# Altium schematic sheet Master MicroController.SchDoc: Master Micro Controller
size A3; DocumentNumber: 13; SheetNumber: 13; SheetTotal: 54
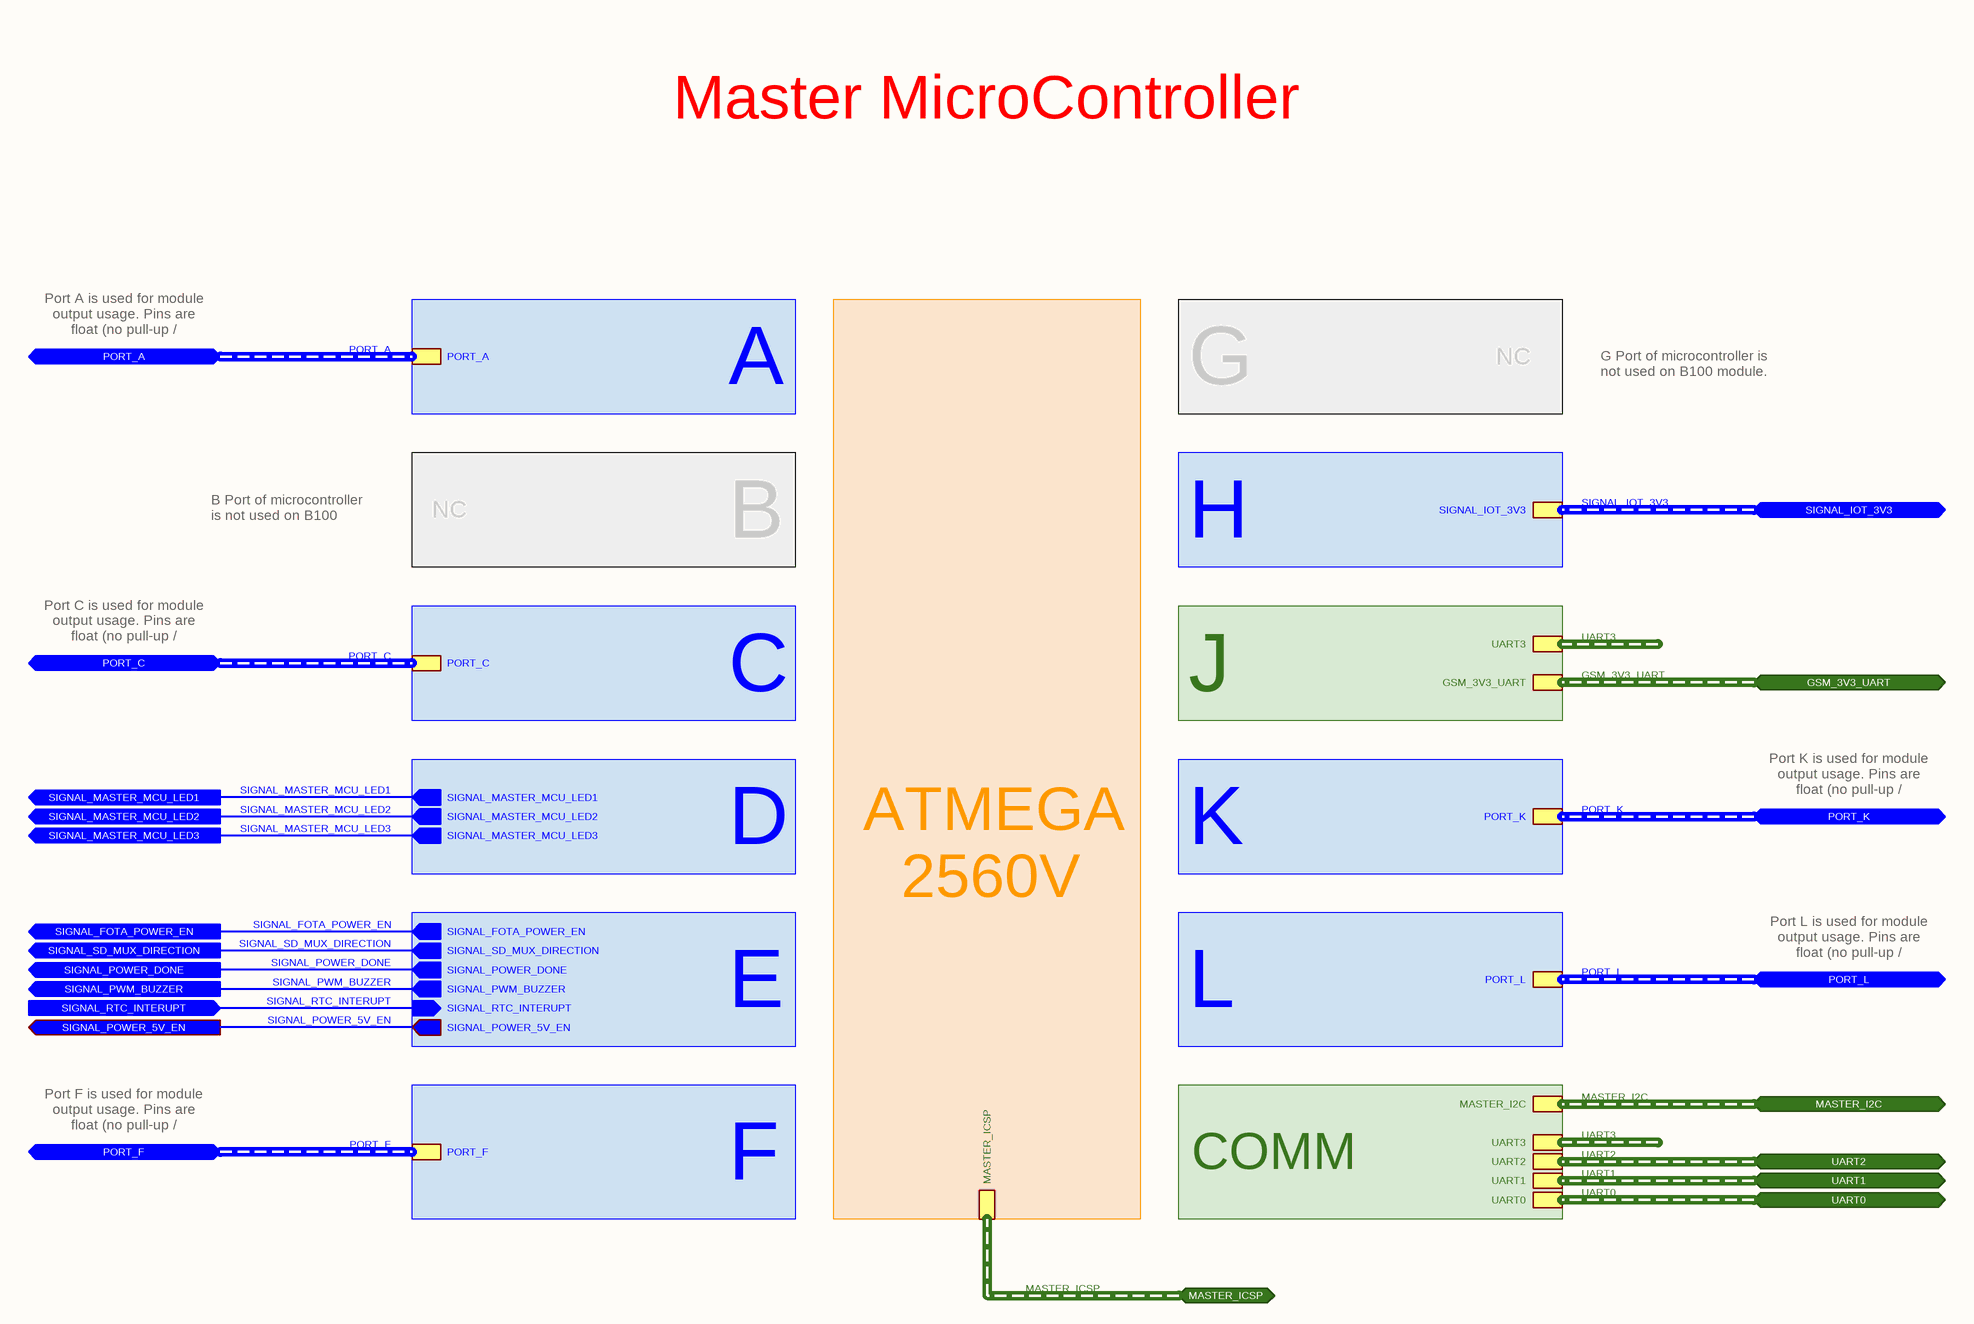
[diagram p0: Master MicroController.SchDoc]

## Sub-sheets
Master MicroController Core = Master MicroController Core.SchDoc: MASTER_ICSP (harness MASTER_ICSP)
PORT A = Master MicroController Port A.SchDoc: PORT_A (harness PORT_A)
PORT B = Master MicroController Port B.SchDoc: no entries
PORT C = Master MicroController Port C.SchDoc: PORT_C (harness PORT_C)
PORT D = Master MicroController Port D.SchDoc: SIGNAL_MASTER_MCU_LED1 (out), SIGNAL_MASTER_MCU_LED3 (out), SIGNAL_MASTER_MCU_LED2 (out)
PORT E = Master MicroController Port E.SchDoc: SIGNAL_FOTA_POWER_EN (out), SIGNAL_SD_MUX_DIRECTION (out), SIGNAL_PWM_BUZZER (out), SIGNAL_RTC_INTERUPT (in), SIGNAL_POWER_DONE (out), SIGNAL_POWER_5V_EN (out)
PORT F = Master MicroController Port F.SchDoc: PORT_F (harness PORT_F)
PORT G = Master MicroController Port G.SchDoc: no entries
PORT H = Master MicroController Port H.SchDoc: SIGNAL_IOT_3V3 (harness SIGNAL_IOT_3V3)
PORT J = Master MicroController Port J.SchDoc: GSM_3V3_UART (harness GSM_3V3_UART), UART3 (harness UART3)
PORT K = Master MicroController Port K.SchDoc: PORT_K (harness PORT_K)
PORT L = Master MicroController Port L.SchDoc: PORT_L (harness PORT_L)
Serial Communication = Master MicroController Serial Communication Port.SchDoc: UART3 (harness UART3), UART1 (harness UART1), UART2 (harness UART2), UART0 (harness UART0), MASTER_I2C (harness MASTER_I2C)

## Ports
GSM_3V3_UART (bidir, harness GSM_3V3_UART), MASTER_I2C (bidir, harness MASTER_I2C), MASTER_ICSP (bidir, harness MASTER_ICSP), PORT_A (bidir, harness PORT_A), PORT_C (bidir, harness PORT_C), PORT_F (bidir, harness PORT_F), PORT_K (bidir, harness PORT_K), PORT_L (bidir, harness PORT_L), SIGNAL_FOTA_POWER_EN (out), SIGNAL_IOT_3V3 (bidir, harness SIGNAL_IOT_3V3), SIGNAL_MASTER_MCU_LED1 (out), SIGNAL_MASTER_MCU_LED2 (out), SIGNAL_MASTER_MCU_LED3 (out), SIGNAL_POWER_5V_EN (out), SIGNAL_POWER_DONE (out), SIGNAL_PWM_BUZZER (out), SIGNAL_RTC_INTERUPT (in), SIGNAL_SD_MUX_DIRECTION (out), UART0 (bidir, harness UART0), UART1 (bidir, harness UART1), UART2 (bidir, harness UART2)

## Nets
SIGNAL_FOTA_POWER_EN: port SIGNAL_FOTA_POWER_EN, sheet PORT E/SIGNAL_FOTA_POWER_EN
SIGNAL_MASTER_MCU_LED1: port SIGNAL_MASTER_MCU_LED1, sheet PORT D/SIGNAL_MASTER_MCU_LED1
SIGNAL_MASTER_MCU_LED2: port SIGNAL_MASTER_MCU_LED2, sheet PORT D/SIGNAL_MASTER_MCU_LED2
SIGNAL_MASTER_MCU_LED3: port SIGNAL_MASTER_MCU_LED3, sheet PORT D/SIGNAL_MASTER_MCU_LED3
SIGNAL_POWER_5V_EN: port SIGNAL_POWER_5V_EN, sheet PORT E/SIGNAL_POWER_5V_EN
SIGNAL_POWER_DONE: port SIGNAL_POWER_DONE, sheet PORT E/SIGNAL_POWER_DONE
SIGNAL_PWM_BUZZER: port SIGNAL_PWM_BUZZER, sheet PORT E/SIGNAL_PWM_BUZZER
SIGNAL_RTC_INTERUPT: port SIGNAL_RTC_INTERUPT, sheet PORT E/SIGNAL_RTC_INTERUPT
SIGNAL_SD_MUX_DIRECTION: port SIGNAL_SD_MUX_DIRECTION, sheet PORT E/SIGNAL_SD_MUX_DIRECTION

## Buses and harness runs
harness GSM_3V3_UART = port GSM_3V3_UART = sheet PORT J/GSM_3V3_UART
harness MASTER_I2C = port MASTER_I2C = sheet Serial Communication/MASTER_I2C
harness MASTER_ICSP = port MASTER_ICSP = sheet Master MicroController Core/MASTER_ICSP
harness PORT_A = port PORT_A = sheet PORT A/PORT_A
harness PORT_C = port PORT_C = sheet PORT C/PORT_C
harness PORT_F = port PORT_F = sheet PORT F/PORT_F
harness PORT_K = port PORT_K = sheet PORT K/PORT_K
harness PORT_L = port PORT_L = sheet PORT L/PORT_L
harness SIGNAL_IOT_3V3 = port SIGNAL_IOT_3V3 = sheet PORT H/SIGNAL_IOT_3V3
harness UART0 = port UART0 = sheet Serial Communication/UART0
harness UART1 = port UART1 = sheet Serial Communication/UART1
harness UART2 = port UART2 = sheet Serial Communication/UART2
harness UART3 = sheet PORT J/UART3
harness UART3 = sheet Serial Communication/UART3

## Notes on the sheet
- Master MicroController
- Port A is used for module output usage. Pins are float (no pull-up / pull-down)
- A
- G
- NC
- G Port of microcontroller is not used on B100 module.
- B Port of microcontroller is not used on B100 module.
- B
- H
- Port C is used for module output usage. Pins are float (no pull-up / pull-down)
- C
- J
- Port K is used for module output usage. Pins are float (no pull-up / pull-down)
- D
- ATMEGA
- 2560V
- K
- Port L is used for module output usage. Pins are float (no pull-up / pull-down)
- E
- L
- Port F is used for module output usage. Pins are float (no pull-up / pull-down)
- F
- COMM
- Engineer
- All Rights are reserved to Customer and Engineer. [2021]
- Size:
- Date:
- A3
- Project :
- Time:
- Sheet
- of
- Customer
- Product ID
- Module ID
- Version
- File:
- Revision